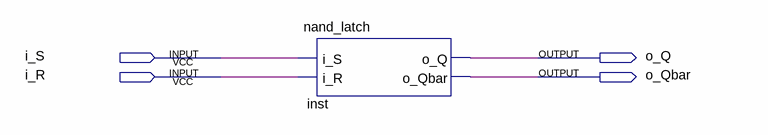
[diagram p0: schematic sheet]
// Quartus schematic nand_latch_sch.bdf as structural Verilog: 1 symbols, 4 pins
module nand_latch_sch (
  input  i_S,
  input  i_R,
  output o_Q,
  output o_Qbar
);

  nand_latch inst (.i_S(i_S), .i_R(i_R), .o_Q(o_Q), .o_Qbar(o_Qbar));
endmodule
